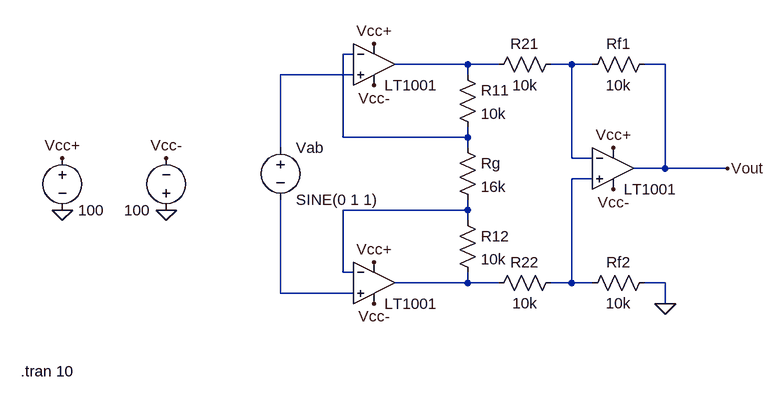
[diagram p0: schematic Instrumentation Amplifier - Run.asc]
Instrumentation Amplifier - Run.asc, the LTspice schematic file:
Version 4
SHEET 1 880 680
WIRE 0 48 -16 48
WIRE 176 64 64 64
WIRE 224 64 176 64
WIRE 336 64 304 64
WIRE 368 64 336 64
WIRE 480 64 448 64
WIRE 0 80 -112 80
WIRE 176 80 176 64
WIRE -16 176 -16 48
WIRE 176 176 176 160
WIRE 176 176 -16 176
WIRE -112 192 -112 80
WIRE 176 192 176 176
WIRE 336 208 336 64
WIRE 368 208 336 208
WIRE 480 224 480 64
WIRE 480 224 432 224
WIRE 576 224 480 224
WIRE 368 240 336 240
WIRE 176 288 176 272
WIRE 176 288 -16 288
WIRE 176 304 176 288
WIRE -16 384 -16 288
WIRE 0 384 -16 384
WIRE 176 400 176 384
WIRE 176 400 64 400
WIRE 224 400 176 400
WIRE 336 400 336 240
WIRE 336 400 304 400
WIRE 368 400 336 400
WIRE 480 400 448 400
WIRE -112 416 -112 272
WIRE 0 416 -112 416
WIRE 480 432 480 400
FLAG 480 432 0
FLAG -448 288 0
FLAG -288 288 0
FLAG -448 208 Vcc+
FLAG -288 208 Vcc-
FLAG 32 368 Vcc+
FLAG 32 32 Vcc+
FLAG 400 192 Vcc+
FLAG 32 432 Vcc-
FLAG 32 96 Vcc-
FLAG 400 256 Vcc-
FLAG 576 224 Vout
SYMBOL res 160 64 R0
SYMATTR InstName R11
SYMATTR Value 10k
SYMBOL res 160 176 R0
SYMATTR InstName Rg
SYMATTR Value 16k
SYMBOL res 160 288 R0
SYMATTR InstName R12
SYMATTR Value 10k
SYMBOL res 464 48 R90
WINDOW 0 0 56 VBottom 2
WINDOW 3 32 56 VTop 2
SYMATTR InstName Rf1
SYMATTR Value 10k
SYMBOL res 464 384 R90
WINDOW 0 0 56 VBottom 2
WINDOW 3 32 56 VTop 2
SYMATTR InstName Rf2
SYMATTR Value 10k
SYMBOL voltage -448 192 R0
WINDOW 123 0 0 Left 2
WINDOW 39 0 0 Left 2
WINDOW 0 24 16 Invisible 2
SYMATTR InstName V2
SYMATTR Value 100
SYMBOL res 320 48 R90
WINDOW 0 0 56 VBottom 2
WINDOW 3 32 56 VTop 2
SYMATTR InstName R21
SYMATTR Value 10k
SYMBOL res 320 384 R90
WINDOW 0 0 56 VBottom 2
WINDOW 3 32 56 VTop 2
SYMATTR InstName R22
SYMATTR Value 10k
SYMBOL Opamps\\LT1001 32 0 R0
WINDOW 0 16 32 Invisible 2
SYMATTR InstName U1
SYMBOL Opamps\\LT1001 32 336 R0
WINDOW 0 16 32 Invisible 2
SYMATTR InstName U2
SYMBOL Opamps\\LT1001 400 160 R0
WINDOW 0 16 32 Invisible 2
SYMATTR InstName U3
SYMBOL voltage -288 304 R180
WINDOW 0 24 96 Invisible 2
WINDOW 3 24 16 Left 2
WINDOW 123 0 0 Left 2
WINDOW 39 0 0 Left 2
SYMATTR InstName V4
SYMATTR Value 100
SYMBOL voltage -112 176 R0
WINDOW 123 0 0 Left 2
WINDOW 39 0 0 Left 2
SYMATTR InstName Vab
SYMATTR Value SINE(0 1 1)
TEXT -512 536 Left 2 !.tran 10

The netlist it stands for:
* Instrumentation Amplifier - Run.asc
R11 N002 N001 10k
Rg N001 N006 16k
R12 N006 N007 10k
Rf1 Vout N003 10k
Rf2 0 N005 10k
V2 Vcc+ 0 100
R21 N003 N002 10k
R22 N005 N007 10k
XU1 N004 N001 Vcc+ Vcc- N002 LT1001  ; pins In+ In- V+ V- OUT
XU2 N008 N006 Vcc+ Vcc- N007 LT1001  ; pins In+ In- V+ V- OUT
XU3 N005 N003 Vcc+ Vcc- Vout LT1001  ; pins In+ In- V+ V- OUT
V4 0 Vcc- 100
Vab N004 N008 SINE(0 1 1)
.tran 10
.lib LTC.lib
.backanno
.end